# Altium schematic sheet Ultrasonic_Localisation.SchDoc
size A4
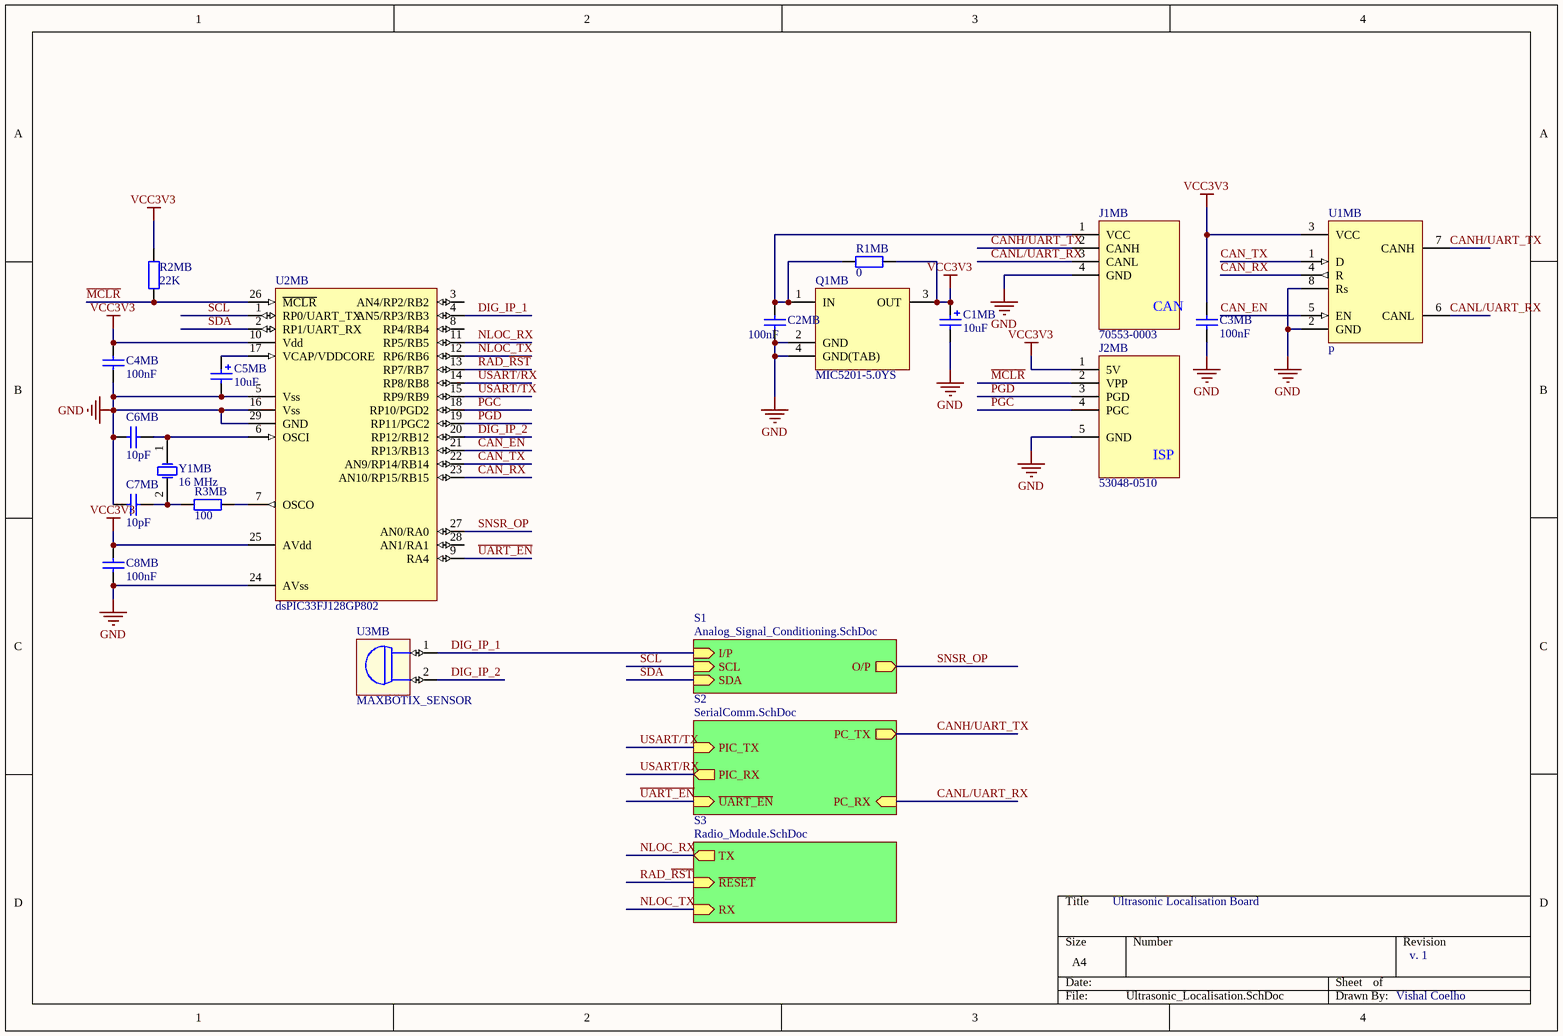
[diagram p0: Ultrasonic_Localisation.SchDoc]

## Parts
C1MB  value 10uF  [TC3528-1411]  (hidden comment: TPSB106K016R0800)
C2MB  value 100nF  [CC1608-0603]  (hidden comment: UMK107BJ104KA-T)
C3MB  value 100nF  [CC1608-0603]  (hidden comment: UMK107BJ104KA-T)
C4MB  value 100nF  [CC1608-0603]  (hidden comment: UMK107BJ104KA-T)
C5MB  value 10uF  [TC3528-1411]  (hidden comment: TPSB106K016R0800)
C6MB  value 10pF  [CC1608-0603]  (hidden comment: Cap)
C7MB  value 10pF  [CC1608-0603]  (hidden comment: Cap)
C8MB  value 100nF  [CC1608-0603]  (hidden comment: UMK107BJ104KA-T)
J1MB  70553-0003  [CON_CAN_Device-4]
J2MB  53048-0510  [CON_ISP]
Q1MB  MIC5201-5.0YS  [DSO-G3]
R1MB  value 0  [CR1608-0603]  (hidden comment: Res)
R2MB  value 22K  [CR1608-0603]  (hidden comment: Res)
R3MB  value 100  [CR1608-0603]  (hidden comment: Res)
U1MB  p  [SO-G8/E2.9]
U2MB  dsPIC33FJ128GP802  [QFN6X6-28]
U3MB  MAXBOTIX_SENSOR  [Maxbotix Sensor]
Y1MB  value 16 MHz  [CS10]  (hidden comment: CS10-16.000MABJ-UT)

## Sub-sheets
S1 = Analog_Signal_Conditioning.SchDoc: I/P (in), O/P (out), SCL (in), SDA (in)
S2 = SerialComm.SchDoc: PIC_RX (out), PC_RX (in), PC_TX (out), PIC_TX (in), ~{UART_EN} (in)
S3 = Radio_Module.SchDoc: TX (out), RX (in), ~{RESET} (in)

## Nets
GND: C1MB.2 C2MB.2 C3MB.2 C4MB.2 C5MB.2 C6MB.1 C7MB.1 C8MB.2 J1MB.4(GND) J2MB.5(GND) Q1MB.2(GND) Q1MB.4(GND(TAB)) U1MB.2(GND) U1MB.8(Rs) U2MB.5(Vss) U2MB.16(Vss) U2MB.24(AVss) U2MB.29(GND)
VCC3V3: C1MB.1 C3MB.1 C4MB.1 C8MB.1 J2MB.1(5V) Q1MB.3(OUT) R1MB.1 R2MB.2 U1MB.3(VCC) U2MB.10(Vdd) U2MB.25(AVdd)
CAN_EN: U1MB.5(EN) U2MB.21(RP13/RB13)
CAN_RX: U1MB.4(R) U2MB.23(AN10/RP15/RB15)
CAN_TX: U1MB.1(D) U2MB.22(AN9/RP14/RB14)
CANH/UART_TX: J1MB.2(CANH) U1MB.7(CANH) ; sheet S2/PC_TX
CANL/UART_RX: J1MB.3(CANL) U1MB.6(CANL) ; sheet S2/PC_RX
DIG_IP_1: U2MB.4(AN5/RP3/RB3) U3MB.1(SNSR_1) ; sheet S1/I/P
DIG_IP_2: U2MB.20(RP12/RB12) U3MB.2(SNSR_2)
~{MCLR}: J2MB.2(VPP) R2MB.1 U2MB.26(~{MCLR})
NLOC_RX: U2MB.11(RP5/RB5) ; sheet S3/TX
NLOC_TX: U2MB.12(RP6/RB6) ; sheet S3/RX
PGC: J2MB.4(PGC) U2MB.18(RP10/PGD2)
PGD: J2MB.3(PGD) U2MB.19(RP11/PGC2)
RAD_~{RST}: U2MB.13(RP7/RB7) ; sheet S3/~{RESET}
SCL: U2MB.1(RP0/UART_TX) ; sheet S1/SCL
SDA: U2MB.2(RP1/UART_RX) ; sheet S1/SDA
SNSR_OP: U2MB.27(AN0/RA0) ; sheet S1/O/P
~{UART_EN}: U2MB.9(RA4) ; sheet S2/~{UART_EN}
USART/RX: U2MB.14(RP8/RB8) ; sheet S2/PIC_RX
USART/TX: U2MB.15(RP9/RB9) ; sheet S2/PIC_TX
NetC2MB_1: C2MB.1 J1MB.1(VCC) Q1MB.1(IN) R1MB.2
NetC5MB_1: C5MB.1 U2MB.17(VCAP/VDDCORE)
NetC6MB_2: C6MB.2 U2MB.6(OSCI) Y1MB.1(OSC1)
NetC7MB_2: C7MB.2 R3MB.2 Y1MB.2(OSC2)
NetR3MB_1: R3MB.1 U2MB.7(OSCO)

Not connected (* = marked no-connect by the designer): U2MB 3(AN4/RP2/RB2) 8(RP4/RB4) 28(AN1/RA1)

## Notes on the sheet
- Ultrasonic Localisation Board
- v. 1
- Vishal Coelho
- (in symbol CON_CAN_DEVICE) CAN
- (in symbol CON_ISP_Header_5p_1.25mm_horizontal) ISP

## Library data of the parts
C1MB C5MB = Cap Pol: Polarized Capacitor (Surface Mount); Manufacturer: AVX; Distributor: Digikey; OrderCode: TPSB106K016R0800
C2MB C3MB C4MB C8MB = Cap: Capacitor; Manufacturer: Taiyo Yuden; Distributor: Digikey; OrderCode: UMK107BJ104KA-T
C6MB C7MB = Cap: Capacitor; Manufacturer: Panasonic; OrderCode: ECJ-1VC1H100D; Distributor: Digikey
J1MB = CON_CAN_DEVICE: 4 pin CAN Connector 2.54mm pitch; Manufacturer: Molex; Distributor: Digikey; OrderCode: 70553-0003
J2MB = CON_ISP_Header_5p_1.25mm_horizontal: 6 pin header - 1.25mm pitch horizontal; Manufacturer: Molex; OrderCode: 53048-0510 + 51021-0500 + 5 x 50079-8000; Distributor: Digikey
Q1MB = MIC5201-5.0YS: 5V LDO 200mA; Manufacturer: Micrel; OrderCode: MIC5201-3.3YS TR; Distributor: Digikey
R1MB R2MB R3MB = Res: Resistor; Distributor: Digikey
U1MB = SN65HVD234D: 3.3V CAN Transceiver; Manufacturer: Texas Instruments; Distributor: Digikey; OrderCode: SN65HVD234D
U2MB = dsPIC33FJ128GP802: dsPIC33FJ128GP802 with 2 UART's; Manufacturer: MicroChip; OrderCode: *
U3MB = MAXBOTIX_SENSOR: Maxbotix Ultrasonic Sensor; Distibutor: *; Manufacturer: Maxbotix; OrderCode: *
Y1MB = CS10: Crystal Oscillator; Manufacturer: Citizen; Distributor: Digikey; OrderCode: CS10-16.000MABJ-UT